# EasyEDA Pro project ProDocument_Board2_2024-09-15.epro, schematic schematic1_1
Create Date: 2024-02-17; Page Name: P1; Project Name: STM32F103开发板-板载stlink; Schematic Name: schematic1_1; Update Date: 2024-02-17; Company: 嘉立创EDA; Page Size: A3; Version: V1.0
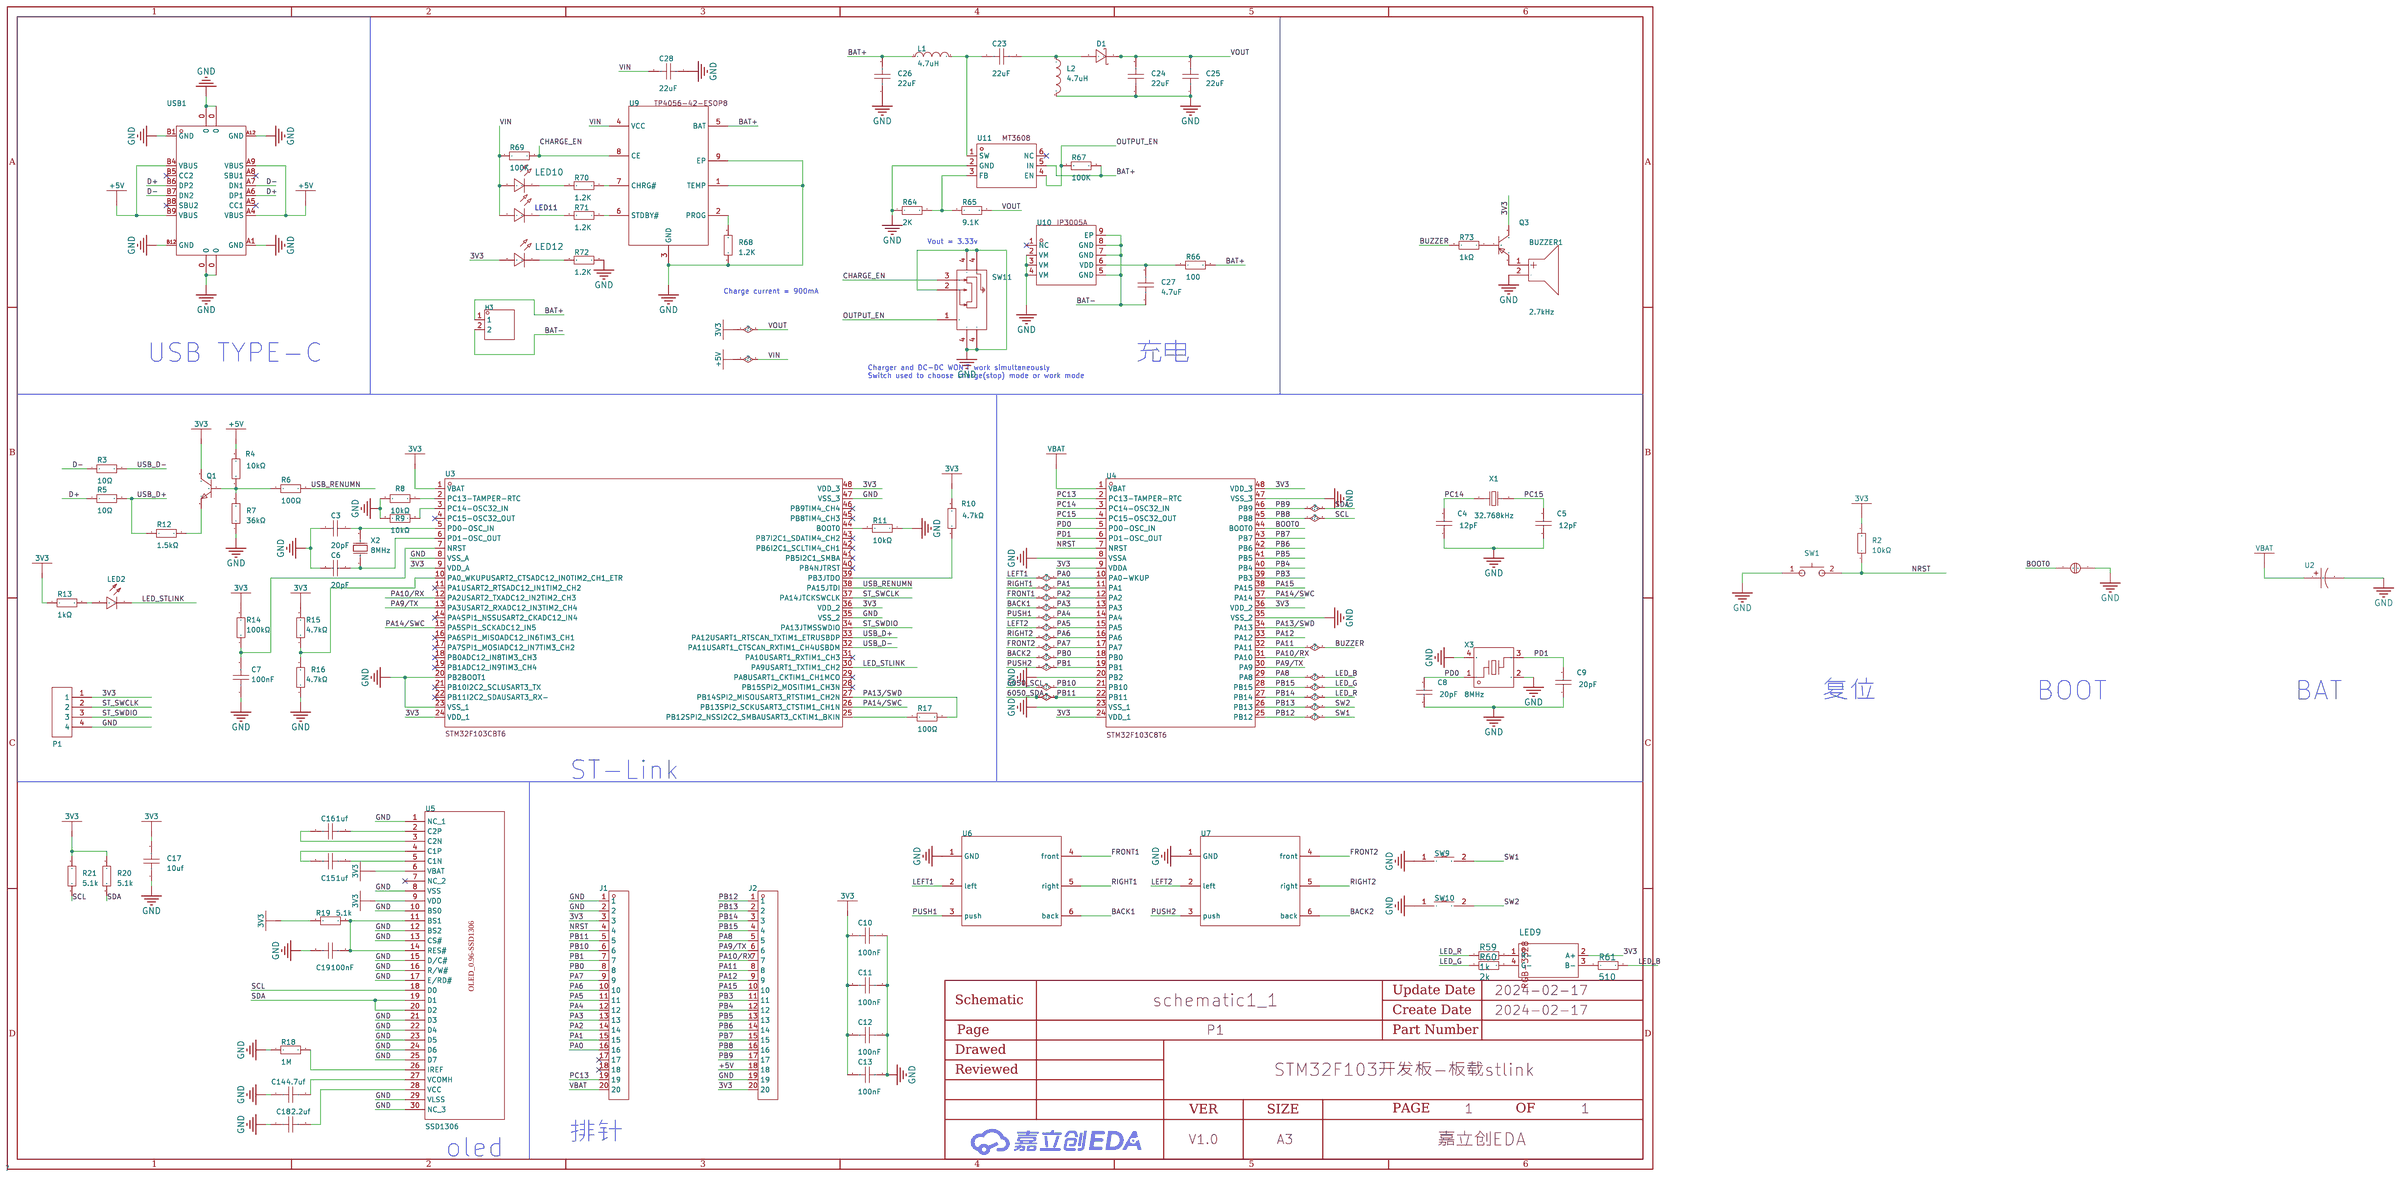
[diagram p0: schematic sheet]

## Parts
BUZZER1  2.7kHz  [BUZ-TH_BD9.0-P5.00-D0.6-FD]
C3  20pF  [C0402]
C4  12pF  [C0402]
C5  12pF  [C0402]
C6  20pF  [C0402]
C7  100nF  [C0402]
C8  20pF  [C0402]
C9  20pF  [C0402]
C10  100nF  [C0402]
C11  100nF  [C0402]
C12  100nF  [C0402]
C13  100nF  [C0402]
C14  4.7uf  [C0603]
C15  1uf  [C0603]
C16  1uf  [C0603]
C17  10uf  [C0603]
C18  2.2uf  [C0603]
C19  100nF  [C0603]
C23  22uF  [C0805]
C24  22uF  [C0805]
C25  22uF  [C0805]
C26  22uF  [C0805]
C27  4.7uF  [C0805]
C28  22uF  [C0805]
D1  SS34  [SMA_L4.3-W2.6-LS5.2-RD]
H3  -  [HDR-TH_2P-P2.54-V-M-1]
J1  -  [HDR-TH_20P-P2.54-V-M-1]
J2  -  [HDR-TH_20P-P2.54-V-M-1]
L1  4.7uH  [IND-SMD_L6.0-W6.0]
L2  4.7uH  [IND-SMD_L6.0-W6.0]
LED2  NCD0603Y1  [LED0603-RD]
LED9  LED-RGB-3528  [LED 3528-4PIN]
LED10  -  [LED_0805]
LED11  -  [LED_0805]
LED12  -  [LED_0805]
P1  -  [1.27-4P烧录孔]  (no BOM)
PAN1  -  [短接焊盘-2mm]  (no BOM)
Q1  S8050 J3Y  [SOT-23-3_L3.0-W1.7-P0.95-LS2.9-BR]
Q3  S8550  [SOT-23-3_L2.9-W1.3-P1.90-LS2.4-BR]
R2  10kΩ  [R0402]
R3  10Ω  [R0402]
R4  10kΩ  [R0402]
R5  10Ω  [R0402]
R6  100Ω  [R0402]
R7  36kΩ  [R0603]
R8  10kΩ  [R0402]
R9  10kΩ  [R0402]
R10  4.7kΩ  [R0402]
R11  10kΩ  [R0402]
R12  1.5kΩ  [R0402]
R13  1kΩ  [R0402]
R14  100kΩ  [R0402]
R15  4.7kΩ  [R0402]
R16  4.7kΩ  [R0402]
R17  100Ω  [R0402]
R18  1M  [R0603]
R19  5.1k  [R0603]
R20  5.1k  [R0603]
R21  5.1k  [R0603]
R59  1k  [R0603]
R60  2k  [R0603]
R61  510  [R0603]
R64  2K  [R0603]
R65  9.1K  [R0603]
R66  100  [R0603]
R67  100K  [R0603]
R68  1.2K  [R0603]
R69  100K  [R0603]
R70  1.2K  [R0603]
R71  1.2K  [R0603]
R72  1.2K  [R0603]
R73  1kΩ  [R0603]
SW1  -  [SW-SMD_L3.9-W2.9-P4.15-LS5.0]
SW9  TS-1101-C-W  [SW-SMD_L6.0-W3.3-LS8.0]
SW10  TS-1101-C-W  [SW-SMD_L6.0-W3.3-LS8.0]
SW11  MSK12C02  [SW-TH_MSK12C02]
U2  -  [CAP-SMD_FL11E]
U3  STM32F103CBT6  [LQFP-48_L7.0-W7.0-P0.50-LS9.0-BL]
U4  -  [LQFP-48_L7.0-W7.0-P0.50-LS9.0-BL]
U5  SSD1306  [1.3OLED-2]
U6  -  [直插五向开关]
U7  -  [直插五向开关]
U9  TP4056-42-ESOP8  [ESOP-8_L4.9-W3.9-P1.27-LS6.0-BL-EP]
U10  IP3005A  [ESOP-8_L4.9-W3.9-P1.27-LS6.0-BL-EP]
U11  MT3608  [SOT-23-6_L2.9-W1.6-P0.95-LS2.8-BL]
USB1  -  [USB-C_SMD-TYPE-C-31-M-12]
X1  32.768kHz  [FC-135R_L3.2-W1.5]
X2  8MHz  [CRYSTAL-SMD_L5.0-W3.2]
X3  8MHz  [CRYSTAL-SMD_4P-L3.2-W2.5-BL]

## Library data of the parts
BUZZER1 = GMD0955YB-3V2700: 驱动方式:有源(内含驱动线路);构造类型:电磁式;频率:2.7kHz;声压(SPL):80dB@3V,10cm;; Supplier Part: C252933; Manufacturer: INGHAi(赢海); JLCPCB Part Class: Extended Part; Datasheet: https://atta.szlcsc.com/upload/public/pdf/source/20200113/C252933_0808B968C54230937A04AB87C18560D6.pdf; Supplier: LCSC; Oscillator Circuit: 有源(内含驱动线路); Technology Type: 电磁式; Operating Voltage: 2V~5V; Sound Pressure Level (SPL): 80dB@3V,10cm; Diameter (φD): 9mm; Height: 5.5mm
C3 C6 C8 C9 = 0402CG200J500NT: 容值:20pF;精度:±5%;额定电压:50V;材质(温度系数):C0G;; LCSC Part Name: 20pF ±5% 50V; Supplier Part: C1554; Manufacturer: FH(风华); Supplier Footprint: 0402; JLCPCB Part Class: Basic Part; Datasheet: https://atta.szlcsc.com/upload/public/pdf/source/20170923/C1554_1506149268708988361.pdf; Supplier: LCSC; Tolerance: ±5%; Voltage Rated: 50V; Temperature Coefficient: C0G
C4 C5 = 0402CG120J500NT: 容值:12pF;精度:±5%;额定电压:50V;材质(温度系数):C0G;; LCSC Part Name: 12pF ±5% 50V; Supplier Part: C1547; Manufacturer: FH(风华); Supplier Footprint: 0402; JLCPCB Part Class: Basic Part; Datasheet: https://atta.szlcsc.com/upload/public/pdf/source/20170923/C1547_1506149265711988354.pdf; Supplier: LCSC; Tolerance: ±5%; Voltage Rated: 50V; Temperature Coefficient: C0G
C7 C10-C13 = CL05B104KB54PNC: 容值:100nF;精度:±10%;额定电压:50V;材质(温度系数):X7R;; LCSC Part Name: 100nF ±10% 50V; Supplier Part: C307331; Manufacturer: SAMSUNG(三星); Supplier Footprint: 0402; JLCPCB Part Class: Basic Part; Datasheet: https://atta.szlcsc.com/upload/public/pdf/source/20181009/C307331_222F7C870FD3EA5F46F538B483443886.pdf; Supplier: LCSC; Tolerance: ±10%; Voltage Rated: 50V; Temperature Coefficient: X7R
C14-C19 = CAP_0603: Supplier Footprint: 0603
C23-C28 = CAP_0805: Supplier Footprint: 0805
D1 = SS34_C8678: 二极管配置:独立式;直流反向耐压(Vr):40V;平均整流电流(Io):3A;正向压降(Vf):550mV@3A;; LCSC Part Name: 40V 3A 550mV@3A; Supplier Part: C8678; Manufacturer: MDD; Supplier Footprint: SMA(DO-214AC); JLCPCB Part Class: 基础库; Datasheet: https://atta.szlcsc.com/upload/public/pdf/source/20230314/A80AE34493C69B89E2F4B1712F433538.pdf; Supplier: LCSC; Diode Configuration: 独立式; Reverse Voltage (Vr): 40V; Average Rectified Current (Io): 3A; Forward Voltage (Vf@If): 550mV@3A; Reverse Leakage Current (Ir): 500uA@40V
H3 = HDR-M_2.54_1x2P: Supplier Part: C124375; Supplier Footprint: 插件
J1 J2 = 2.54-1*20P直针: 间距:2.54mm;总PIN位数:20;排数:1;插针结构:-;行距:-;安装类型:直插;圆针/方针:-;额定电流:-;额定电压:-;配合针长度:-;塑高:-;触头材质:黄铜;触头镀层:-;颜色:黑色;; LCSC Part Name: 2.54mm; Supplier Part: C50981; Manufacturer: BOOMELE(博穆精密); Supplier Footprint: 插件,P=2.54mm; JLCPCB Part Class: Extended Part; Datasheet: https://atta.szlcsc.com/upload/public/pdf/source/20151109/1457707571495.pdf; Supplier: LCSC; Pitch: 2.54mm; Number of Pins: 20; Number of Rows: 1; Mounting Type: 直插; Contact Material: 黄铜; Color: 黑色
L1 L2 = SLW6028S4R7MST: 电感值:4.7uH;精度:±20%;额定电流:3A;; LCSC Part Name: 4.7uH ±20% 3A 39mΩ; Supplier Part: C206281; Manufacturer: Sunltech(韩国顺磁); Supplier Footprint: SMD; JLCPCB Part Class: 扩展库; Datasheet: https://atta.szlcsc.com/upload/public/pdf/source/20180403/C206281_491B9967FE0214DFDFCD19C54400AF6E.pdf; Supplier: LCSC; Tolerance: ±20%; Rated Current: 3A; DC Resistance (DCR): 39mΩ
LED2 = NCD0603Y1: 发光颜色:黄灯;; LCSC Part Name: 黄灯; Supplier Part: C84268; Manufacturer: 国星光电; Supplier Footprint: 0603; JLCPCB Part Class: Extended Part; Datasheet: https://atta.szlcsc.com/upload/public/pdf/source/20200820/C84268_8FC106CB292CF978F9CFC6892464F83C.pdf; Supplier: LCSC; Emitted Color: 黄灯
LED9 = ?
LED10 LED12 = LED_0805-R: Supplier Footprint: 0805
LED11 = LED_0805-G: Supplier Footprint: 0805
P1 = 1.27-4P烧录孔
PAN1 = 短接焊盘-2mm
Q1 = S8050 J3Y: 晶体管类型:NPN;集射极击穿电压(Vceo):25V;集电极电流(Ic):500mA;功率(Pd):300mW;集电极-发射极饱和电压(VCE(sat)@Ic,Ib):600mV@500mA,50mA;直流电流增益(hFE@Ic,Vce):200@50mA,1V;特征频率(fT):150MHz;工作温度:+150@(Tj);; LCSC Part Name: S8050 J3Y (200-350) (200-350); Supplier Part: C2146; Manufacturer: CJ（江苏长电/长晶）; Supplier Footprint: SOT-23(SOT-23-3); JLCPCB Part Class: Basic Part; Datasheet: https://atta.szlcsc.com/upload/public/pdf/source/20140809/1457707209234.pdf; Supplier: LCSC; Transistor Type: NPN; Collector-Emitter Breakdown Voltage (Vceo): 25V; Collector Current (Ic): 500mA; Power Dissipation (Pd): 300mW; Collector-Emitter Saturation Voltage (VCE(sat)@Ic,Ib): 600mV@500mA,50mA; DC Current Gain (hFE@Ic,Vce): 200@50mA,1V; Transition Frequency (fT): 150MHz; Operating Temperature: +150@(Tj)
Q3 = S8550_C2891805: Supplier Part: C2891805; Manufacturer: YONGYUTAI(永裕泰); Supplier Footprint: SOT-23; JLCPCB Part Class: 扩展库; Datasheet: https://atta.szlcsc.com/upload/public/pdf/source/20210901/65C3C4D1695A9271DEFEFE0B623CB3B1.pdf; Supplier: LCSC
R2 R4 R8 R9 R11 = 0402WGF1002TCE: 电阻类型:厚膜电阻;阻值:10kΩ;精度:±1%;功率:62.5mW;温度系数:±100ppm/;最大工作电压:50V;工作温度范围:-55~+155;; LCSC Part Name: 10kΩ ±1% 62.5mW; Supplier Part: C25744; Manufacturer: UNI-ROYAL(厚声); Supplier Footprint: 0402; JLCPCB Part Class: Basic Part; Datasheet: https://atta.szlcsc.com/upload/public/pdf/source/20200306/C422600_1E6D84923E4A46A82E41ADD87F860B5C.pdf; Supplier: LCSC; Type: 厚膜电阻; Tolerance: ±1%; Power(Watts): 62.5mW; Temperature Coefficient: ±100ppm/; Overload Voltage (Max): 50V; Operating Temperature Range: -55~+155
R3 R5 = 0402WGF100JTCE: 电阻类型:厚膜电阻;阻值:10Ω;精度:±1%;功率:62.5mW;温度系数:±200ppm/;最大工作电压:50V;工作温度范围:-55~+155;; LCSC Part Name: 10Ω ±1% 62.5mW; Supplier Part: C25077; Manufacturer: UNI-ROYAL(厚声); Supplier Footprint: 0402; JLCPCB Part Class: Basic Part; Datasheet: https://atta.szlcsc.com/upload/public/pdf/source/20200306/C422600_1E6D84923E4A46A82E41ADD87F860B5C.pdf; Supplier: LCSC; Type: 厚膜电阻; Tolerance: ±1%; Power(Watts): 62.5mW; Temperature Coefficient: ±200ppm/; Overload Voltage (Max): 50V; Operating Temperature Range: -55~+155
R6 R17 = 0402WGF1000TCE: 电阻类型:厚膜电阻;阻值:100Ω;精度:±1%;功率:62.5mW;温度系数:±200ppm/;最大工作电压:50V;工作温度范围:-55~+155;; LCSC Part Name: 100Ω ±1% 62.5mW; Supplier Part: C25076; Manufacturer: UNI-ROYAL(厚声); Supplier Footprint: 0402; JLCPCB Part Class: Basic Part; Datasheet: https://atta.szlcsc.com/upload/public/pdf/source/20200306/C422600_1E6D84923E4A46A82E41ADD87F860B5C.pdf; Supplier: LCSC; Type: 厚膜电阻; Tolerance: ±1%; Power(Watts): 62.5mW; Temperature Coefficient: ±200ppm/; Overload Voltage (Max): 50V; Operating Temperature Range: -55~+155
R7 = 0603WAF3602T5E: 电阻类型:厚膜电阻;阻值:36kΩ;精度:±1%;功率:100mW;温度系数:±100ppm/;最大工作电压:75V;工作温度范围:-55~+155;; LCSC Part Name: 36kΩ ±1% 100mW; Supplier Part: C23147; Manufacturer: UNI-ROYAL(厚声); Supplier Footprint: 0603; JLCPCB Part Class: Basic Part; Datasheet: https://atta.szlcsc.com/upload/public/pdf/source/20200306/C422600_1E6D84923E4A46A82E41ADD87F860B5C.pdf; Supplier: LCSC; Type: 厚膜电阻; Tolerance: ±1%; Power(Watts): 100mW; Temperature Coefficient: ±100ppm/; Overload Voltage (Max): 75V; Operating Temperature Range: -55~+155
R10 R15 R16 = 0402WGF4701TCE: 电阻类型:厚膜电阻;阻值:4.7kΩ;精度:±1%;功率:62.5mW;温度系数:±100ppm/;最大工作电压:50V;工作温度范围:-55~+155;; LCSC Part Name: 4.7kΩ ±1% 62.5mW; Supplier Part: C25900; Manufacturer: UNI-ROYAL(厚声); Supplier Footprint: 0402; JLCPCB Part Class: Basic Part; Datasheet: https://atta.szlcsc.com/upload/public/pdf/source/20200306/C422600_1E6D84923E4A46A82E41ADD87F860B5C.pdf; Supplier: LCSC; Type: 厚膜电阻; Tolerance: ±1%; Power(Watts): 62.5mW; Temperature Coefficient: ±100ppm/; Overload Voltage (Max): 50V; Operating Temperature Range: -55~+155
R12 = 0402WGF1501TCE: 电阻类型:厚膜电阻;阻值:1.5kΩ;精度:±1%;功率:62.5mW;温度系数:±100ppm/;最大工作电压:50V;工作温度范围:-55~+155;; LCSC Part Name: 1.5kΩ ±1% 62.5mW; Supplier Part: C25867; Manufacturer: UNI-ROYAL(厚声); Supplier Footprint: 0402; JLCPCB Part Class: Basic Part; Datasheet: https://atta.szlcsc.com/upload/public/pdf/source/20200306/C422600_1E6D84923E4A46A82E41ADD87F860B5C.pdf; Supplier: LCSC; Type: 厚膜电阻; Tolerance: ±1%; Power(Watts): 62.5mW; Temperature Coefficient: ±100ppm/; Overload Voltage (Max): 50V; Operating Temperature Range: -55~+155
R13 = 0402WGF1001TCE: 电阻类型:厚膜电阻;阻值:1kΩ;精度:±1%;功率:62.5mW;温度系数:±100ppm/;最大工作电压:50V;工作温度范围:-55~+155;; LCSC Part Name: 1kΩ ±1% 62.5mW; Supplier Part: C11702; Manufacturer: UNI-ROYAL(厚声); Supplier Footprint: 0402; JLCPCB Part Class: Basic Part; Datasheet: https://atta.szlcsc.com/upload/public/pdf/source/20200306/C422600_1E6D84923E4A46A82E41ADD87F860B5C.pdf; Supplier: LCSC; Type: 厚膜电阻; Tolerance: ±1%; Power(Watts): 62.5mW; Temperature Coefficient: ±100ppm/; Overload Voltage (Max): 50V; Operating Temperature Range: -55~+155
R14 = 0402WGF1003TCE: 电阻类型:厚膜电阻;阻值:100kΩ;精度:±1%;功率:62.5mW;温度系数:±100ppm/;最大工作电压:50V;工作温度范围:-55~+155;; LCSC Part Name: 100kΩ ±1% 62.5mW; Supplier Part: C25741; Manufacturer: UNI-ROYAL(厚声); Supplier Footprint: 0402; JLCPCB Part Class: Basic Part; Datasheet: https://atta.szlcsc.com/upload/public/pdf/source/20200306/C422600_1E6D84923E4A46A82E41ADD87F860B5C.pdf; Supplier: LCSC; Type: 厚膜电阻; Tolerance: ±1%; Power(Watts): 62.5mW; Temperature Coefficient: ±100ppm/; Overload Voltage (Max): 50V; Operating Temperature Range: -55~+155
R18-R21 R64-R72 = Res_0603: Supplier Footprint: 0603
R59-R61 = WR06X1201FTL: Supplier: LCSC; Manufacturer: WALSIN; Resistance: 1.2K; Supplier Part: C163838; JLCPCB Part Class: Extended Part
R73 = 0603WAF1001T5E: 电阻类型:厚膜电阻;阻值:1kΩ;精度:±1%;功率:100mW;; LCSC Part Name: 1kΩ ±1% 100mW; Supplier Part: C21190; Manufacturer: UNI-ROYAL(厚声); Supplier Footprint: 0603; JLCPCB Part Class: Basic Part; Datasheet: https://atta.szlcsc.com/upload/public/pdf/source/20200306/C422600_1E6D84923E4A46A82E41ADD87F860B5C.pdf; Supplier: LCSC; Type: 厚膜电阻; Tolerance: ±1%; Power(Watts): 100mW; Temperature Coefficient: ±100ppm/℃; Overload Voltage (Max): 75V; Operating Temperature Range: -55℃~+155℃
SW1 = GT-TC029B-H025-L1N: 触点电流:50mA;额定电压(DC):12V;绝缘电阻:100MΩ;电路结构:单刀单掷;安装方式:立贴;按钮形状:圆形按钮;按钮/盖帽颜色:黑色;带灯:无;作用力:250gf@±30gf;机械寿命:100000;工作温度:-30℃~+85℃;引脚样式:SMD接片;开关长度:3.9mm;开关宽度:2.9mm;开关高度:2.5mm;带支架:否;; LCSC Part Name: 立式两脚小龟H2.5 250gf 无柱; Supplier Part: C843669; Manufacturer: G-Switch(品赞); Supplier Footprint: SMD,3×4×2.5mm; JLCPCB Part Class: Extended Part; Datasheet: https://atta.szlcsc.com/upload/public/pdf/source/20201014/C843665_B07D254A2E90B746498E934B945CCD5F.pdf; Supplier: LCSC; Contact Current: 50mA; Voltage Rating (DC): 12V; Insulation Resistance: 100MΩ; Circuit: 单刀单掷; Mounting Style: 立贴; Actuator Style: 圆形按钮; Actuator/Cap Color: 黑色; With Lamp: 无; Operating Force: 250gf@±30gf; Mechanical Life: 100000; Operating Temperature: -30℃~+85℃; Pin Style: SMD接片; Switch Length: 3.9mm; Switch Width: 2.9mm; Switch Height: 2.5mm; Strike Gundam: 否
SW9 SW10 = TS-1101-C-W: 触点电流:50mA;额定电压(AC):-;额定电压(DC):12V;额定功率:-;绝缘电阻:-;电路结构:单刀单掷;安装方式:立贴;带灯:无;作用力:260gf;机械寿命:5万次;带支架:否;; LCSC Part Name: 立贴 6*3.6*2.5mm 轻触开关 一型3*6*2.5有白ZD b拉伸白色带淡绿按键 卷装; Supplier Part: C318938; Manufacturer: XKB Connectivity(中国星坤); Supplier Footprint: SMD; JLCPCB Part Class: 扩展库; Datasheet: https://atta.szlcsc.com/upload/public/pdf/source/20200227/C318938_C2E53B1EEDE37D980A33616AC086DE53.pdf; Supplier: LCSC; Contact Current: 50mA; Voltage Rating (DC): 12V; Circuit: 单刀单掷; Mounting Style: 立贴; Actuator Style: 矩形按钮; Actuator/Cap Color: 白色带淡绿; With Lamp: 无; Operating Force: 260gf; Mechanical Life: 5万次; Operating Temperature: -30℃~+85℃; Switch Length: 6mm; Switch Width: 3.6mm; Switch Height: 2.5mm; Strike Gundam: 否
SW11 = MSK12C02: LCSC Part Name: 两档侧拨贴片 7脚 拨动 白柄 柄长1.5mm,带定位柱; Supplier Part: C431540; Manufacturer: SHOU HAN(首韩); Supplier Footprint: SMD; JLCPCB Part Class: 扩展库; Datasheet: https://atta.szlcsc.com/upload/public/pdf/source/20190925/C431540_89155AEF0758B9AD1B2D805F83FB12E3.pdf; Supplier: LCSC
U2 = MS621FE-FL11E: 3.3V可充电纽扣电池 5.5mAH; Supplier Part: C80909; Manufacturer: Seiko(精工); Supplier Footprint: FL11E; JLCPCB Part Class: Extended Part; Datasheet: https://atta.szlcsc.com/upload/public/pdf/source/20170818/C80909_1503051330396895396.pdf; Supplier: LCSC
U3 = STM32F103CBT6: 主频（MAX):72MHz;工作电压:2V ~ 3.6V;; Supplier Part: C8304; Manufacturer: ST(意法半导体); Supplier Footprint: LQFP-48_7x7x05P; JLCPCB Part Class: Extended Part; Datasheet: https://atta.szlcsc.com/upload/public/pdf/source/20140724/1457707170379.pdf; Supplier: LCSC; Speed: 72MHz; Voltage - Supply (Vcc/Vdd): 2V ~ 3.6V; RAM Size: 20KB; Number of I/O: 37; A/D: 16x12bit; PWM: 13; UART/USART: 3 USART; I2C（SMBUS/PMBUS）: 2; USB Device: 1; CAN: 1
U4 = STM32F103C8T6: 工作电压:2V ~ 3.6V;CPU位数:32-Bit;CPU内核:ARM® Cortex®-M3;主频（MAX):72MHz;ROM类型:FLASH;; Supplier Part: C8734; Manufacturer: ST(意法半导体); Supplier Footprint: LQFP-48_7x7x05P; JLCPCB Part Class: Basic Part; Datasheet: https://atta.szlcsc.com/upload/public/pdf/source/20140724/1457707174202.pdf; Supplier: LCSC
U5 = SSD1306
U6 U7 = 直插五向开关
U9 = TP4056-42-ESOP8: 锂电池充电芯片; LCSC Part Name: TP4056-42-ESOP8 编带; Supplier Part: C16581; Manufacturer: TOPPOWER(南京拓微); Supplier Footprint: ESOP-8; JLCPCB Part Class: 基础库; Datasheet: https://atta.szlcsc.com/upload/public/pdf/source/20160713/1468379849914.pdf; Supplier: LCSC
U10 = IP3005A: 过充电压:4.28V,过充恢复电压:4.1V,高精度内置MOSFET单节锂电池保护IC; Supplier Part: C181685; Manufacturer: INJOINIC(英集芯); Supplier Footprint: ESOP-8; JLCPCB Part Class: 扩展库; Datasheet: https://atta.szlcsc.com/upload/public/pdf/source/20181019/C181685_8FCD62B90ABBC24A3EFF28CA6DF89AAB.pdf; Supplier: LCSC
U11 = MT3608: 功能类型:升压型;输入电压:2V~24V;输出电压:28V;输出电流(最大值):-;; LCSC Part Name: 升压型 输入2V~24V 输出28V; Supplier Part: C84817; Manufacturer: 西安航天民芯; Supplier Footprint: SOT-23-6; JLCPCB Part Class: 扩展库; Datasheet: https://atta.szlcsc.com/upload/public/pdf/source/20161110/1478743351706.pdf; Supplier: LCSC; Function: 升压型; Number of Outputs: 1; Topology: 升压式; Input Voltage: 2V~24V; Output Voltage: 28V; Switching Frequency: 1.2MHz
USB1 = TYPE-C-31-M-12: 连接器类型:Type-C;标准:-;公母:母座;触点数量:16;端口数量:1;额定电流 - 电源:250mA;; Supplier Part: C165948; Manufacturer: 韩国韩荣; JLCPCB Part Class: Extended Part; Datasheet: https://atta.szlcsc.com/upload/public/pdf/source/20210111/C2682493_D8CCFED08835E878D16ACCF4460E43B8.pdf; Supplier: LCSC; Connector Type: Type-C; Gender: 母座; Number of Contacts: 16; Number of Ports: 1; Current Rating - Power (Max): 250mA
X1 = Q13FC1350000400: 晶振类型:贴片无源晶振;频率:32.768kHz;频率公差:±20ppm;频率稳定度:-;负载电容:12.5pF;等效串联电阻(ESR):70kΩ;工作温度:-40℃~+85℃;; LCSC Part Name: 32.768kHz ±20ppm 12.5pF; Supplier Part: C32346; Manufacturer: EPSON(爱普生); Supplier Footprint: SMD3215-2P; JLCPCB Part Class: Basic Part; Datasheet: https://atta.szlcsc.com/upload/public/pdf/source/20190108/C32346_746D6B07EAF90824457A96480007685F.pdf; Supplier: LCSC; Crystal Type: 贴片无源晶振; Frequency Tolerance: ±20ppm; Load Capacitance: 12.5pF; Equivalent Series Resistance (ESR): 70kΩ; Operating Temperature: -40℃~+85℃
X2 = X50328MSB2GI: 晶振类型:贴片无源晶振;频率:8MHz;频率公差:±10ppm;频率稳定度:±50ppm;负载电容:20pF;工作温度:-40~+85;; LCSC Part Name: YSX530GA 8MHZ  20PF 10PPM -40~+85; Supplier Part: C115962; Manufacturer: YXC扬兴科技; Supplier Footprint: SMD5032-2P; JLCPCB Part Class: Basic Part; Datasheet: https://atta.szlcsc.com/upload/public/pdf/source/20210329/C112559_847D3CACBA33ACCEB57DEA3AEBB187A1.pdf; Supplier: LCSC; Crystal Type: 贴片无源晶振; Frequency Tolerance: ±10ppm; Frequency Stability: ±50ppm; Load Capacitance: 20pF; Operating Temperature: -40~+85
X3 = X32258MSB4SI: 晶振类型:贴片无源晶振;频率:8MHz;频率公差:±10ppm;频率稳定度:±30ppm;负载电容:20pF;工作温度:-40℃~+85℃;; LCSC Part Name: 20pF ±10ppm 8MHz; Supplier Part: C2682774; Manufacturer: YXC扬兴科技; Supplier Footprint: SMD3225-4P; JLCPCB Part Class: Extended Part; Datasheet: https://atta.szlcsc.com/upload/public/pdf/source/20210106/C2682774_0CD4FDA5D9DA3FBEEC23BD607A48E4B0.pdf; Supplier: LCSC; Crystal Type: 贴片无源晶振; Frequency Tolerance: ±10ppm; Frequency Stability: ±30ppm; Load Capacitance: 20pF; Operating Temperature: -40℃~+85℃

## Nets
3V3: C10.2 C11.2 C12.2 C13.2 C17.2 C24.2 C25.2 D1.1(K) J1.3 J2.20 LED9.2(A+) LED12.2(A) P1.1 Q1.3(C) Q3.3(C) R2.2 R10.2 R13.1 R14.2 R15.2 R19.1 R20.1 R21.1 R65.2 U3.1(VBAT) U3.9(VDD_A) U3.24(VDD_1) U3.36(VDD_2) U3.48(VDD_3) U4.9(VDDA) U4.24(VDD_1) U4.36(VDD_2) U4.48(VDD_3) U5.6(VBAT) U5.9(VDD)
+5V: C28.2 J2.18 LED10.2(A) LED11.2(A) R4.2 R69.1 U9.4(VCC) USB1.A4(VBUS) USB1.A9(VBUS) USB1.B4(VBUS) USB1.B9(VBUS)
GND: BUZZER1.2(-) C3.2 C4.1 C5.2 C6.2 C7.1 C8.1 C9.1 C10.1 C11.1 C12.1 C13.1 C14.1 C17.1 C18.1 C19.2 C24.1 C25.1 C26.1 C28.1 J1.1 J1.2 J2.19 L2.2 P1.4 PAN1.1(Pin1) R7.1 R8.2 R9.2 R11.1 R16.1 R18.1 R64.1 R68.1 R72.1 SW1.1 SW9.1 SW10.1 SW11.2 SW11.4 U2.2 U3.8(VSS_A) U3.20(PB2BOOT1) U3.23(VSS_1) U3.35(VSS_2) U3.47(VSS_3) U4.8(VSSA) U4.20(PB2) U4.23(VSS_1) U4.35(VSS_2) U4.47(VSS_3) U5.1(NC) U5.8(VSS) U5.10(BS0) U5.12(BS2) U5.13(CS#) U5.15(D/C#) U5.16(R/W#) U5.17(E/RD#) U5.21(D3) U5.22(D4) U5.23(D5) U5.24(D6) U5.25(D7) U5.29(VLSS) U5.30(NC_3) U6.1(GND) U7.1(GND) U9.1(TEMP) U9.3(GND) U9.9(EP) U10.2(VM) U10.3(VM) U10.4(VM) U11.2(GND) USB1.0 USB1.A1(GND) USB1.A12(GND) USB1.B1(GND) USB1.B12(GND) X3.2(GND) X3.4(GND)
VBAT: J1.20 U2.1 U4.1(VBAT)
6050_SCL: J1.6 U4.21(PB10)
6050_SDA: J1.5 U4.22(PB11)
BACK1: J1.13 U4.13(PA3) U6.6(back)
BACK2: J1.8 U4.18(PB0) U7.6(back)
BAT+: C26.2 H3.1 L1.1 R66.2 R67.2 U9.5(BAT) U11.5(IN)
BAT-: C27.1 H3.2 U10.5(GND) U10.7(GND) U10.8(GND) U10.9(EP)
BOOT0: PAN1.2(Pin2) U4.44(BOOT0)
BUZZER: J2.8 R73.2 U4.32(PA11)
CHARGE_EN: R69.2 SW11.3 U9.8(CE)
D+: R5.1 USB1.A6(DP1) USB1.B6(DP2)
D-: R3.1 USB1.A7(DN1) USB1.B7(DN2)
FRONT1: J1.14 U4.12(PA2) U6.4(front)
FRONT2: J1.9 U4.17(PA7) U7.4(front)
LED_B: J2.5 R61.2 U4.29(PA8)
LED_G: J2.4 R60.1 U4.28(PB15)
LED_R: J2.3 R59.1 U4.27(PB14)
LED_STLINK: LED2.1(K) U3.30(PA9USART1_TXTIM1_CH2)
LEFT1: J1.16 U4.10(PA0-WKUP) U6.2(left)
LEFT2: J1.11 U4.15(PA5) U7.2(left)
NRST: J1.4 R2.1 SW1.2 U4.7(NRST)
OUTPUT_EN: R67.1 SW11.1 U11.4(EN)
PA1: J1.15 U4.11(PA1) U6.5(right)
PA4: J1.12 U4.14(PA4) U6.3(push)
PA6: J1.10 U4.16(PA6) U7.5(right)
PA9/TX: J2.6 U3.13(PA3USART2_RXADC12_IN3TIM2_CH4) U4.30(PA9)
PA10/RX: J2.7 U3.12(PA2USART2_TXADC12_IN2TIM2_CH3) U4.31(PA10)
PA12: J2.9 U4.33(PA12)
PA13/SWD: R17.2 U3.27(PB14SPI2_MISOUSART3_RTSTIM1_CH2N) U4.34(PA13)
PA14/SWC: U3.15(PA5SPI1_SCKADC12_IN5) U3.26(PB13SPI2_SCKUSART3_CTSTIM1_CH1N) U4.37(PA14)
PA15: J2.10 U4.38(PA15)
PB1: J1.7 U4.19(PB1) U7.3(push)
PB3: J2.11 U4.39(PB3)
PB4: J2.12 U4.40(PB4)
PB5: J2.13 U4.41(PB5)
PB6: J2.14 U4.42(PB6)
PB7: J2.15 U4.43(PB7)
PB8: J2.16 R21.2 U4.45(PB8) U5.18(D0)
PB9: J2.17 R20.2 U4.46(PB9) U5.19(D1) U5.20(D2)
PB12: J2.1 SW9.2 U4.25(PB12)
PB13: J2.2 SW10.2 U4.26(PB13)
PC13: J1.19 U4.2(PC13-TAMPER-RTC)
PC14: C4.2 U4.3(PC14-OSC32_IN) X1.1
PC15: C5.1 U4.4(PC15-OSC32_OUT) X1.2
PD0: C8.2 U4.5(PD0-OSC_IN) X3.1
PD1: C9.2 U4.6(PD1-OSC_OUT) X3.3
ST_SWCLK: P1.2 U3.37(PA14JTCKSWCLK)
ST_SWDIO: P1.3 U3.34(PA13JTMSSWDIO)
USB_D+: R5.2 R12.1 U3.33(PA12USART1_RTSCAN_TXTIM1_ETRUSBDP)
USB_D-: R3.2 U3.32(PA11USART1_CTSCAN_RXTIM1_CH4USBDM)
USB_RENUMN: R6.2 U3.38(PA15JTDI)
$1N12780: Q1.2(E) R12.2
$1N12782: Q1.1(B) R4.1 R6.1 R7.2
$1N12786: R8.1 U3.2(PC13-TAMPER-RTC)
$1N12787: R9.1 U3.3(PC14-OSC32_IN)
$1N12790: C3.1 U3.5(PD0-OSC_IN) X2.2(OSC2)
$1N12791: C6.1 U3.6(PD1-OSC_OUT) X2.1(OSC1)
$1N12796: R15.1 R16.2 U3.10(PA0_WKUPUSART2_CTSADC12_IN0TIM2_CH1_ETR)
$1N12798: C7.2 R14.1 U3.7(NRST)
$1N12808: R17.1 U3.25(PB12SPI2_NSSI2C2_SMBAUSART3_CKTIM1_BKIN)
$1N12820: R10.1 U3.39(PB3JTDO)
$1N12821: R11.2 U3.44(BOOT0)
$1N12835: LED2.2(A) R13.2
$1N33098: R18.2 U5.26(IREF)
$1N33099: C14.2 U5.27(VCOMH)
$1N33110: C15.2 U5.5(C1N)
$1N33111: C15.1 U5.4(C1P)
$1N33112: C16.1 U5.3(C2N)
$1N33113: C16.2 U5.2(C2P)
$1N33117: C18.2 U5.28(VCC)
$1N33128: C19.1 R19.2 U5.11(BS1) U5.14(RES#)
$1N36511: LED9.1(R-) R59.2
$1N36512: LED9.4(G-) R60.2
$1N36513: LED9.3(B-) R61.1
$1N40234: C23.1 L1.2 U11.1(SW)
$1N40236: C23.2 D1.2(A) L2.1
$1N40247: R64.2 R65.1 U11.3(FB)
$1N40253: C27.2 R66.1 U10.6(VDD)
$1N40259: R68.2 U9.2(PROG)
$1N40260: R70.1 U9.7(CHRG#)
$1N40261: R71.1 U9.6(STDBY#)
$1N51257: Q3.1(B) R73.1
$1N51262: BUZZER1.1(+) Q3.2(E)
Net-(LED10-1): LED10.1(C) R70.2
Net-(LED11-1): LED11.1(C) R71.2
Net-(LED12-1): LED12.1(C) R72.2

Not connected (* = marked no-connect by the designer): J1 17* 18*; U3 4(PC15-OSC32_OUT)* 11(PA1USART2_RTSADC12_IN1TIM2_CH2)* 14(PA4SPI1_NSSUSART2_CKADC12_IN4)* 16(PA6SPI1_MISOADC12_IN6TIM3_CH1)* 17(PA7SPI1_MOSIADC12_IN7TIM3_CH2)* 18(PB0ADC12_IN8TIM3_CH3)* 19(PB1ADC12_IN9TIM3_CH4)* 21(PB10I2C2_SCLUSART3_TX)* 22(PB11I2C2_SDAUSART3_RX-)* 28(PB15SPI2_MOSITIM1_CH3N)* 29(PA8USART1_CKTIM1_CH1MCO)* 31(PA10USART1_RXTIM1_CH3)* 40(PB4NJTRST)* 41(PB5I2C1_SMBA)* 42(PB6I2C1_SCLTIM4_CH1)* 43(PB7I2C1_SDATIM4_CH2)* 45(PB8TIM4_CH3)* 46(PB9TIM4_CH4)*; U5 7(NC_2)*; U10 1(NC)*; U11 6(NC)*; USB1 A5(CC1)* A8(SBU1)* B5(CC2)* B8(SBU2)*

## Notes on the sheet
- Vout = 3.33v
- Charge current = 900mA
- USB TYPE-C
- 充电
- Charger and DC-DC WON'T work simultaneously
  Switch used to choose charge(stop) mode or work mode
- 复位
- BOOT
- BAT
- ST-Link
- 排针
- oled
